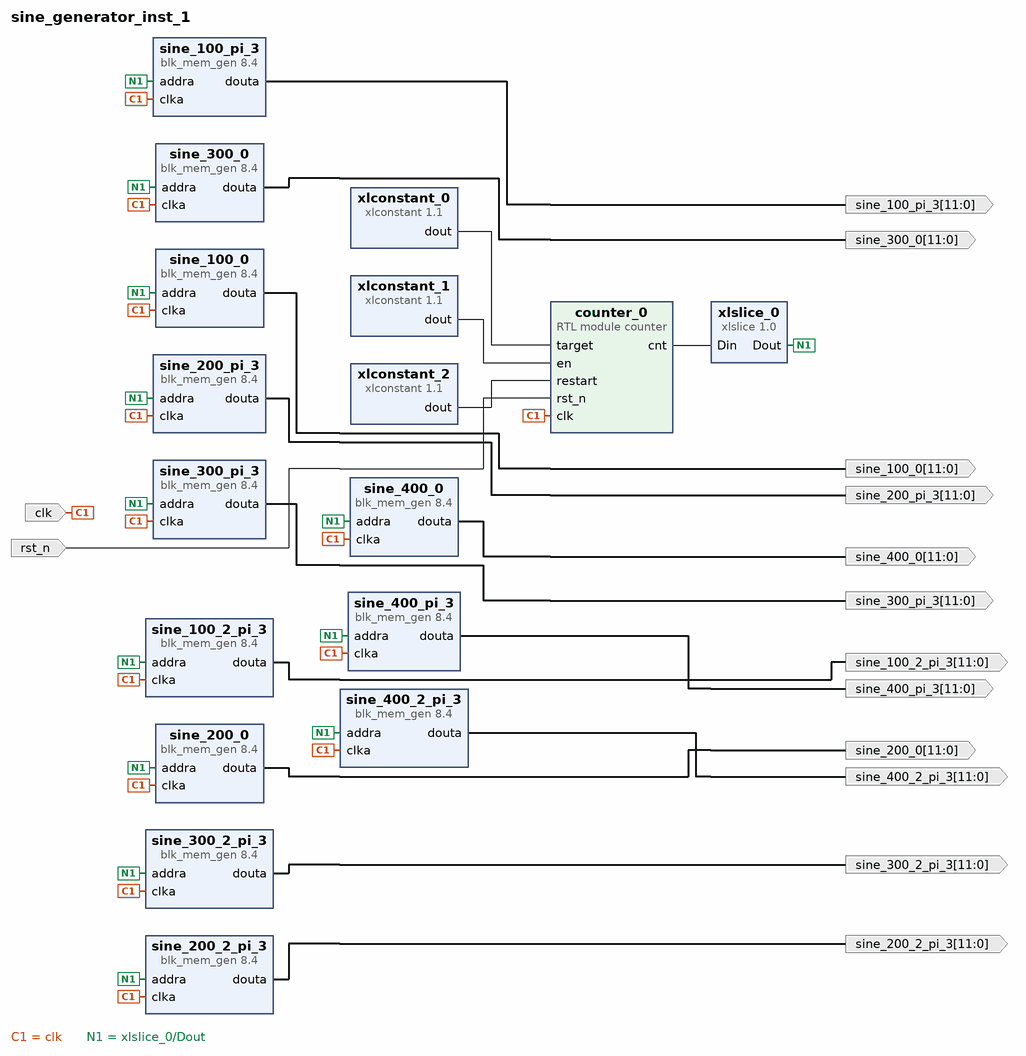
[diagram p0: block diagram of the top level]
# Vivado block design sine_generator_inst_1, xczu3eg-sbva484-1-i, Vivado 2020.2
create_bd_design sine_generator_inst_1

create_bd_port -dir I -type rst rst_n
create_bd_port -dir I -type clk clk
create_bd_port -dir O -from 11 -to 0 sine_100_pi_3
create_bd_port -dir O -from 11 -to 0 sine_400_0
create_bd_port -dir O -from 11 -to 0 sine_300_0
create_bd_port -dir O -from 11 -to 0 sine_100_0
create_bd_port -dir O -from 11 -to 0 sine_200_pi_3
create_bd_port -dir O -from 11 -to 0 sine_300_pi_3
create_bd_port -dir O -from 11 -to 0 sine_100_2_pi_3
create_bd_port -dir O -from 11 -to 0 sine_200_0
create_bd_port -dir O -from 11 -to 0 sine_300_2_pi_3
create_bd_port -dir O -from 11 -to 0 sine_400_pi_3
create_bd_port -dir O -from 11 -to 0 sine_200_2_pi_3
create_bd_port -dir O -from 11 -to 0 sine_400_2_pi_3

create_bd_cell -type ip -vlnv xilinx.com:ip:blk_mem_gen:8.4 sine_100_0
set_property -dict [list \
  CONFIG.Coe_File ../../../../../../../../../../testing/BufferFlowControl/data/sine_100_0.coe \
  CONFIG.Enable_32bit_Address false \
  CONFIG.Enable_A Always_Enabled \
  CONFIG.Load_Init_File true \
  CONFIG.Memory_Type Single_Port_ROM \
  CONFIG.Port_A_Write_Rate 0 \
  CONFIG.Register_PortA_Output_of_Memory_Primitives true \
  CONFIG.Use_RSTA_Pin false \
  CONFIG.Write_Depth_A 7813 \
  CONFIG.Write_Width_A 12 \
  CONFIG.use_bram_block Stand_Alone \
] [get_bd_cells sine_100_0]
create_bd_cell -type ip -vlnv xilinx.com:ip:blk_mem_gen:8.4 sine_100_pi_3
set_property -dict [list \
  CONFIG.Coe_File ../../../../../../../../../../testing/BufferFlowControl/data/sine_100_pi_3.coe \
  CONFIG.Enable_32bit_Address false \
  CONFIG.Enable_A Always_Enabled \
  CONFIG.Fill_Remaining_Memory_Locations false \
  CONFIG.Load_Init_File true \
  CONFIG.Memory_Type Single_Port_ROM \
  CONFIG.Port_A_Write_Rate 0 \
  CONFIG.Register_PortA_Output_of_Memory_Primitives true \
  CONFIG.Use_RSTA_Pin false \
  CONFIG.Write_Depth_A 7813 \
  CONFIG.Write_Width_A 12 \
  CONFIG.use_bram_block Stand_Alone \
] [get_bd_cells sine_100_pi_3]
create_bd_cell -type ip -vlnv xilinx.com:ip:blk_mem_gen:8.4 sine_100_2_pi_3
set_property -dict [list \
  CONFIG.Coe_File ../../../../../../../../../../testing/BufferFlowControl/data/sine_100_2_pi_3.coe \
  CONFIG.Enable_32bit_Address false \
  CONFIG.Enable_A Always_Enabled \
  CONFIG.Load_Init_File true \
  CONFIG.Memory_Type Single_Port_ROM \
  CONFIG.Port_A_Write_Rate 0 \
  CONFIG.Register_PortA_Output_of_Memory_Primitives true \
  CONFIG.Use_RSTA_Pin false \
  CONFIG.Write_Depth_A 7813 \
  CONFIG.Write_Width_A 12 \
  CONFIG.use_bram_block Stand_Alone \
] [get_bd_cells sine_100_2_pi_3]
create_bd_cell -type ip -vlnv xilinx.com:ip:blk_mem_gen:8.4 sine_200_0
set_property -dict [list \
  CONFIG.Coe_File ../../../../../../../../../../testing/BufferFlowControl/data/sine_200_0.coe \
  CONFIG.Enable_32bit_Address false \
  CONFIG.Enable_A Always_Enabled \
  CONFIG.Load_Init_File true \
  CONFIG.Memory_Type Single_Port_ROM \
  CONFIG.Port_A_Write_Rate 0 \
  CONFIG.Register_PortA_Output_of_Memory_Primitives true \
  CONFIG.Use_RSTA_Pin false \
  CONFIG.Write_Depth_A 7813 \
  CONFIG.Write_Width_A 12 \
  CONFIG.use_bram_block Stand_Alone \
] [get_bd_cells sine_200_0]
create_bd_cell -type ip -vlnv xilinx.com:ip:blk_mem_gen:8.4 sine_200_2_pi_3
set_property -dict [list \
  CONFIG.Coe_File ../../../../../../../../../../testing/BufferFlowControl/data/sine_200_2_pi_3.coe \
  CONFIG.Enable_32bit_Address false \
  CONFIG.Enable_A Always_Enabled \
  CONFIG.Load_Init_File true \
  CONFIG.Memory_Type Single_Port_ROM \
  CONFIG.Port_A_Write_Rate 0 \
  CONFIG.Register_PortA_Output_of_Memory_Primitives true \
  CONFIG.Use_RSTA_Pin false \
  CONFIG.Write_Depth_A 7813 \
  CONFIG.Write_Width_A 12 \
  CONFIG.use_bram_block Stand_Alone \
] [get_bd_cells sine_200_2_pi_3]
create_bd_cell -type ip -vlnv xilinx.com:ip:blk_mem_gen:8.4 sine_200_pi_3
set_property -dict [list \
  CONFIG.Coe_File ../../../../../../../../../../testing/BufferFlowControl/data/sine_200_pi_3.coe \
  CONFIG.Enable_32bit_Address false \
  CONFIG.Enable_A Always_Enabled \
  CONFIG.Load_Init_File true \
  CONFIG.Memory_Type Single_Port_ROM \
  CONFIG.Port_A_Write_Rate 0 \
  CONFIG.Register_PortA_Output_of_Memory_Primitives true \
  CONFIG.Use_RSTA_Pin false \
  CONFIG.Write_Depth_A 7813 \
  CONFIG.Write_Width_A 12 \
  CONFIG.use_bram_block Stand_Alone \
] [get_bd_cells sine_200_pi_3]
create_bd_cell -type ip -vlnv xilinx.com:ip:blk_mem_gen:8.4 sine_300_0
set_property -dict [list \
  CONFIG.Coe_File ../../../../../../../../../../testing/BufferFlowControl/data/sine_300_0.coe \
  CONFIG.Enable_32bit_Address false \
  CONFIG.Enable_A Always_Enabled \
  CONFIG.Load_Init_File true \
  CONFIG.Memory_Type Single_Port_ROM \
  CONFIG.Port_A_Write_Rate 0 \
  CONFIG.Register_PortA_Output_of_Memory_Primitives true \
  CONFIG.Use_RSTA_Pin false \
  CONFIG.Write_Depth_A 7813 \
  CONFIG.Write_Width_A 12 \
  CONFIG.use_bram_block Stand_Alone \
] [get_bd_cells sine_300_0]
create_bd_cell -type ip -vlnv xilinx.com:ip:blk_mem_gen:8.4 sine_300_2_pi_3
set_property -dict [list \
  CONFIG.Coe_File ../../../../../../../../../../testing/BufferFlowControl/data/sine_300_2_pi_3.coe \
  CONFIG.Enable_32bit_Address false \
  CONFIG.Enable_A Always_Enabled \
  CONFIG.Load_Init_File true \
  CONFIG.Memory_Type Single_Port_ROM \
  CONFIG.Port_A_Write_Rate 0 \
  CONFIG.Register_PortA_Output_of_Memory_Primitives true \
  CONFIG.Use_RSTA_Pin false \
  CONFIG.Write_Depth_A 7813 \
  CONFIG.Write_Width_A 12 \
  CONFIG.use_bram_block Stand_Alone \
] [get_bd_cells sine_300_2_pi_3]
create_bd_cell -type ip -vlnv xilinx.com:ip:blk_mem_gen:8.4 sine_300_pi_3
set_property -dict [list \
  CONFIG.Coe_File ../../../../../../../../../../testing/BufferFlowControl/data/sine_300_pi_3.coe \
  CONFIG.Enable_32bit_Address false \
  CONFIG.Enable_A Always_Enabled \
  CONFIG.Load_Init_File true \
  CONFIG.Memory_Type Single_Port_ROM \
  CONFIG.Port_A_Write_Rate 0 \
  CONFIG.Register_PortA_Output_of_Memory_Primitives true \
  CONFIG.Use_RSTA_Pin false \
  CONFIG.Write_Depth_A 7813 \
  CONFIG.Write_Width_A 12 \
  CONFIG.use_bram_block Stand_Alone \
] [get_bd_cells sine_300_pi_3]
create_bd_cell -type ip -vlnv xilinx.com:ip:blk_mem_gen:8.4 sine_400_0
set_property -dict [list \
  CONFIG.Coe_File ../../../../../../../../../../testing/BufferFlowControl/data/sine_400_0.coe \
  CONFIG.Enable_32bit_Address false \
  CONFIG.Enable_A Always_Enabled \
  CONFIG.Load_Init_File true \
  CONFIG.Memory_Type Single_Port_ROM \
  CONFIG.Port_A_Write_Rate 0 \
  CONFIG.Register_PortA_Output_of_Memory_Primitives true \
  CONFIG.Use_RSTA_Pin false \
  CONFIG.Write_Depth_A 7813 \
  CONFIG.Write_Width_A 12 \
  CONFIG.use_bram_block Stand_Alone \
] [get_bd_cells sine_400_0]
create_bd_cell -type ip -vlnv xilinx.com:ip:blk_mem_gen:8.4 sine_400_2_pi_3
set_property -dict [list \
  CONFIG.Coe_File ../../../../../../../../../../testing/BufferFlowControl/data/sine_400_2_pi_3.coe \
  CONFIG.Enable_32bit_Address false \
  CONFIG.Enable_A Always_Enabled \
  CONFIG.Load_Init_File true \
  CONFIG.Memory_Type Single_Port_ROM \
  CONFIG.Port_A_Write_Rate 0 \
  CONFIG.Register_PortA_Output_of_Memory_Primitives true \
  CONFIG.Use_RSTA_Pin false \
  CONFIG.Write_Depth_A 7813 \
  CONFIG.Write_Width_A 12 \
  CONFIG.use_bram_block Stand_Alone \
] [get_bd_cells sine_400_2_pi_3]
create_bd_cell -type ip -vlnv xilinx.com:ip:blk_mem_gen:8.4 sine_400_pi_3
set_property -dict [list \
  CONFIG.Coe_File ../../../../../../../../../../testing/BufferFlowControl/data/sine_400_pi_3.coe \
  CONFIG.Enable_32bit_Address false \
  CONFIG.Enable_A Always_Enabled \
  CONFIG.Load_Init_File true \
  CONFIG.Memory_Type Single_Port_ROM \
  CONFIG.Port_A_Write_Rate 0 \
  CONFIG.Register_PortA_Output_of_Memory_Primitives true \
  CONFIG.Use_RSTA_Pin false \
  CONFIG.Write_Depth_A 7813 \
  CONFIG.Write_Width_A 12 \
  CONFIG.use_bram_block Stand_Alone \
] [get_bd_cells sine_400_pi_3]
create_bd_cell -type module -reference counter counter_0
set_property -dict {CONFIG.n_bits 21} [get_bd_cells counter_0]
create_bd_cell -type ip -vlnv xilinx.com:ip:xlconstant:1.1 xlconstant_0
set_property -dict {CONFIG.CONST_VAL 2000127 CONFIG.CONST_WIDTH 21} [get_bd_cells xlconstant_0]
create_bd_cell -type ip -vlnv xilinx.com:ip:xlconstant:1.1 xlconstant_1
create_bd_cell -type ip -vlnv xilinx.com:ip:xlconstant:1.1 xlconstant_2
set_property -dict {CONFIG.CONST_VAL 0} [get_bd_cells xlconstant_2]
create_bd_cell -type ip -vlnv xilinx.com:ip:xlslice:1.0 xlslice_0
set_property -dict {CONFIG.DIN_FROM 20 CONFIG.DIN_TO 8 CONFIG.DIN_WIDTH 21 CONFIG.DOUT_WIDTH 13} [get_bd_cells xlslice_0]

# ---- connections ----

connect_bd_net [get_bd_pins xlconstant_0/dout] [get_bd_pins counter_0/target]
connect_bd_net -net rst_n_0_1 [get_bd_ports rst_n] [get_bd_pins counter_0/rst_n]
connect_bd_net -net clk_0_1 [get_bd_ports clk] \
  [get_bd_pins counter_0/clk] [get_bd_pins sine_100_pi_3/clka] [get_bd_pins sine_200_2_pi_3/clka] \
  [get_bd_pins sine_200_0/clka] [get_bd_pins sine_100_0/clka] [get_bd_pins sine_400_2_pi_3/clka] \
  [get_bd_pins sine_200_pi_3/clka] [get_bd_pins sine_100_2_pi_3/clka] [get_bd_pins sine_300_pi_3/clka] \
  [get_bd_pins sine_300_0/clka] [get_bd_pins sine_300_2_pi_3/clka] [get_bd_pins sine_400_pi_3/clka] \
  [get_bd_pins sine_400_0/clka]
connect_bd_net [get_bd_pins xlconstant_1/dout] [get_bd_pins counter_0/en]
connect_bd_net [get_bd_pins xlconstant_2/dout] [get_bd_pins counter_0/restart]
connect_bd_net -net counter_0_cnt [get_bd_pins xlslice_0/Dout] \
  [get_bd_pins sine_400_2_pi_3/addra] [get_bd_pins sine_100_pi_3/addra] [get_bd_pins sine_100_0/addra] \
  [get_bd_pins sine_100_2_pi_3/addra] [get_bd_pins sine_200_pi_3/addra] [get_bd_pins sine_200_0/addra] \
  [get_bd_pins sine_200_2_pi_3/addra] [get_bd_pins sine_300_pi_3/addra] [get_bd_pins sine_300_0/addra] \
  [get_bd_pins sine_300_2_pi_3/addra] [get_bd_pins sine_400_pi_3/addra] [get_bd_pins sine_400_0/addra]
connect_bd_net [get_bd_pins sine_100_pi_3/douta] [get_bd_ports sine_100_pi_3]
connect_bd_net [get_bd_pins sine_400_0/douta] [get_bd_ports sine_400_0]
connect_bd_net [get_bd_pins sine_300_0/douta] [get_bd_ports sine_300_0]
connect_bd_net [get_bd_pins sine_100_0/douta] [get_bd_ports sine_100_0]
connect_bd_net [get_bd_pins sine_200_pi_3/douta] [get_bd_ports sine_200_pi_3]
connect_bd_net [get_bd_pins sine_300_pi_3/douta] [get_bd_ports sine_300_pi_3]
connect_bd_net [get_bd_pins sine_100_2_pi_3/douta] [get_bd_ports sine_100_2_pi_3]
connect_bd_net [get_bd_pins sine_200_0/douta] [get_bd_ports sine_200_0]
connect_bd_net [get_bd_pins sine_300_2_pi_3/douta] [get_bd_ports sine_300_2_pi_3]
connect_bd_net [get_bd_pins sine_400_pi_3/douta] [get_bd_ports sine_400_pi_3]
connect_bd_net [get_bd_pins sine_200_2_pi_3/douta] [get_bd_ports sine_200_2_pi_3]
connect_bd_net [get_bd_pins sine_400_2_pi_3/douta] [get_bd_ports sine_400_2_pi_3]
connect_bd_net [get_bd_pins counter_0/cnt] [get_bd_pins xlslice_0/Din]

validate_bd_design
save_bd_design
